# EAGLE schematic Tapuino (EAGLE 6.4)
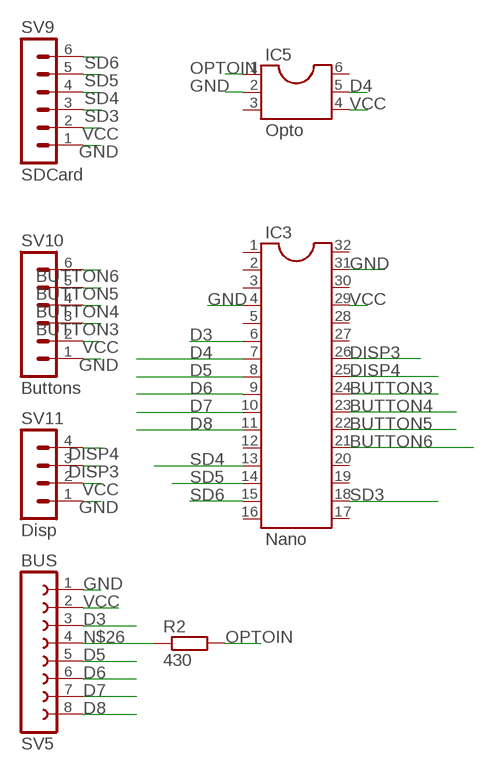
[diagram p0: schematic, sheet 1]

## Parts
IC3  Nano  DIL32  [DIL32]
IC5  Opto  DIL6  [DIL06]
R2  430  R-EU_0207/10  [0207/10]
SV5  BUS  FE08-1  [FE08]
SV9  SDCard  MA06-1  [MA06-1]
SV10  Buttons  MA06-1  [MA06-1]
SV11  Disp  MA04-1  [MA04-1]

## Nets
BUTTON3: IC3.24 SV10.3
BUTTON4: IC3.23 SV10.4
BUTTON5: IC3.22 SV10.5
BUTTON6: IC3.21 SV10.6
D3: IC3.6 SV5.3
D4: IC3.7 IC5.5
D5: IC3.8 SV5.5
D6: IC3.9 SV5.6
D7: IC3.10 SV5.7
D8: IC3.11 SV5.8
DISP3: IC3.26 SV11.3
DISP4: IC3.25 SV11.4
GND: IC3.4 IC3.31 IC5.2 SV5.1 SV9.1 SV10.1 SV11.1
N$26: R2.1 SV5.4
OPTOIN: IC5.1 R2.2
SD3: IC3.18 SV9.3
SD4: IC3.13 SV9.4
SD5: IC3.14 SV9.5
SD6: IC3.15 SV9.6
VCC: IC3.29 IC5.4 SV5.2 SV9.2 SV10.2 SV11.2
Unconnected: IC3.1 IC3.2 IC3.3 IC3.5 IC3.12 IC3.16 IC3.17 IC3.19 IC3.20 IC3.27 IC3.28 IC3.30 IC3.32 IC5.3 IC5.6

## Library data of the parts
IC3 = ic-package:DIL32: Dual In Line
IC5 = ic-package:DIL6: Dual In Line / Socket
R2 = rcl:R-EU_: RESISTOR, European symbol
SV5 = con-lsta:FE08-1: FEMALE HEADER; OC_FARNELL: unknown; OC_NEWARK: unknown
SV9 SV10 = con-lstb:MA06-1: PIN HEADER; OC_FARNELL: unknown; OC_NEWARK: unknown
SV11 = con-lstb:MA04-1: PIN HEADER; OC_FARNELL: unknown; OC_NEWARK: unknown